# Altium project Rys_PCB.PrjPcb
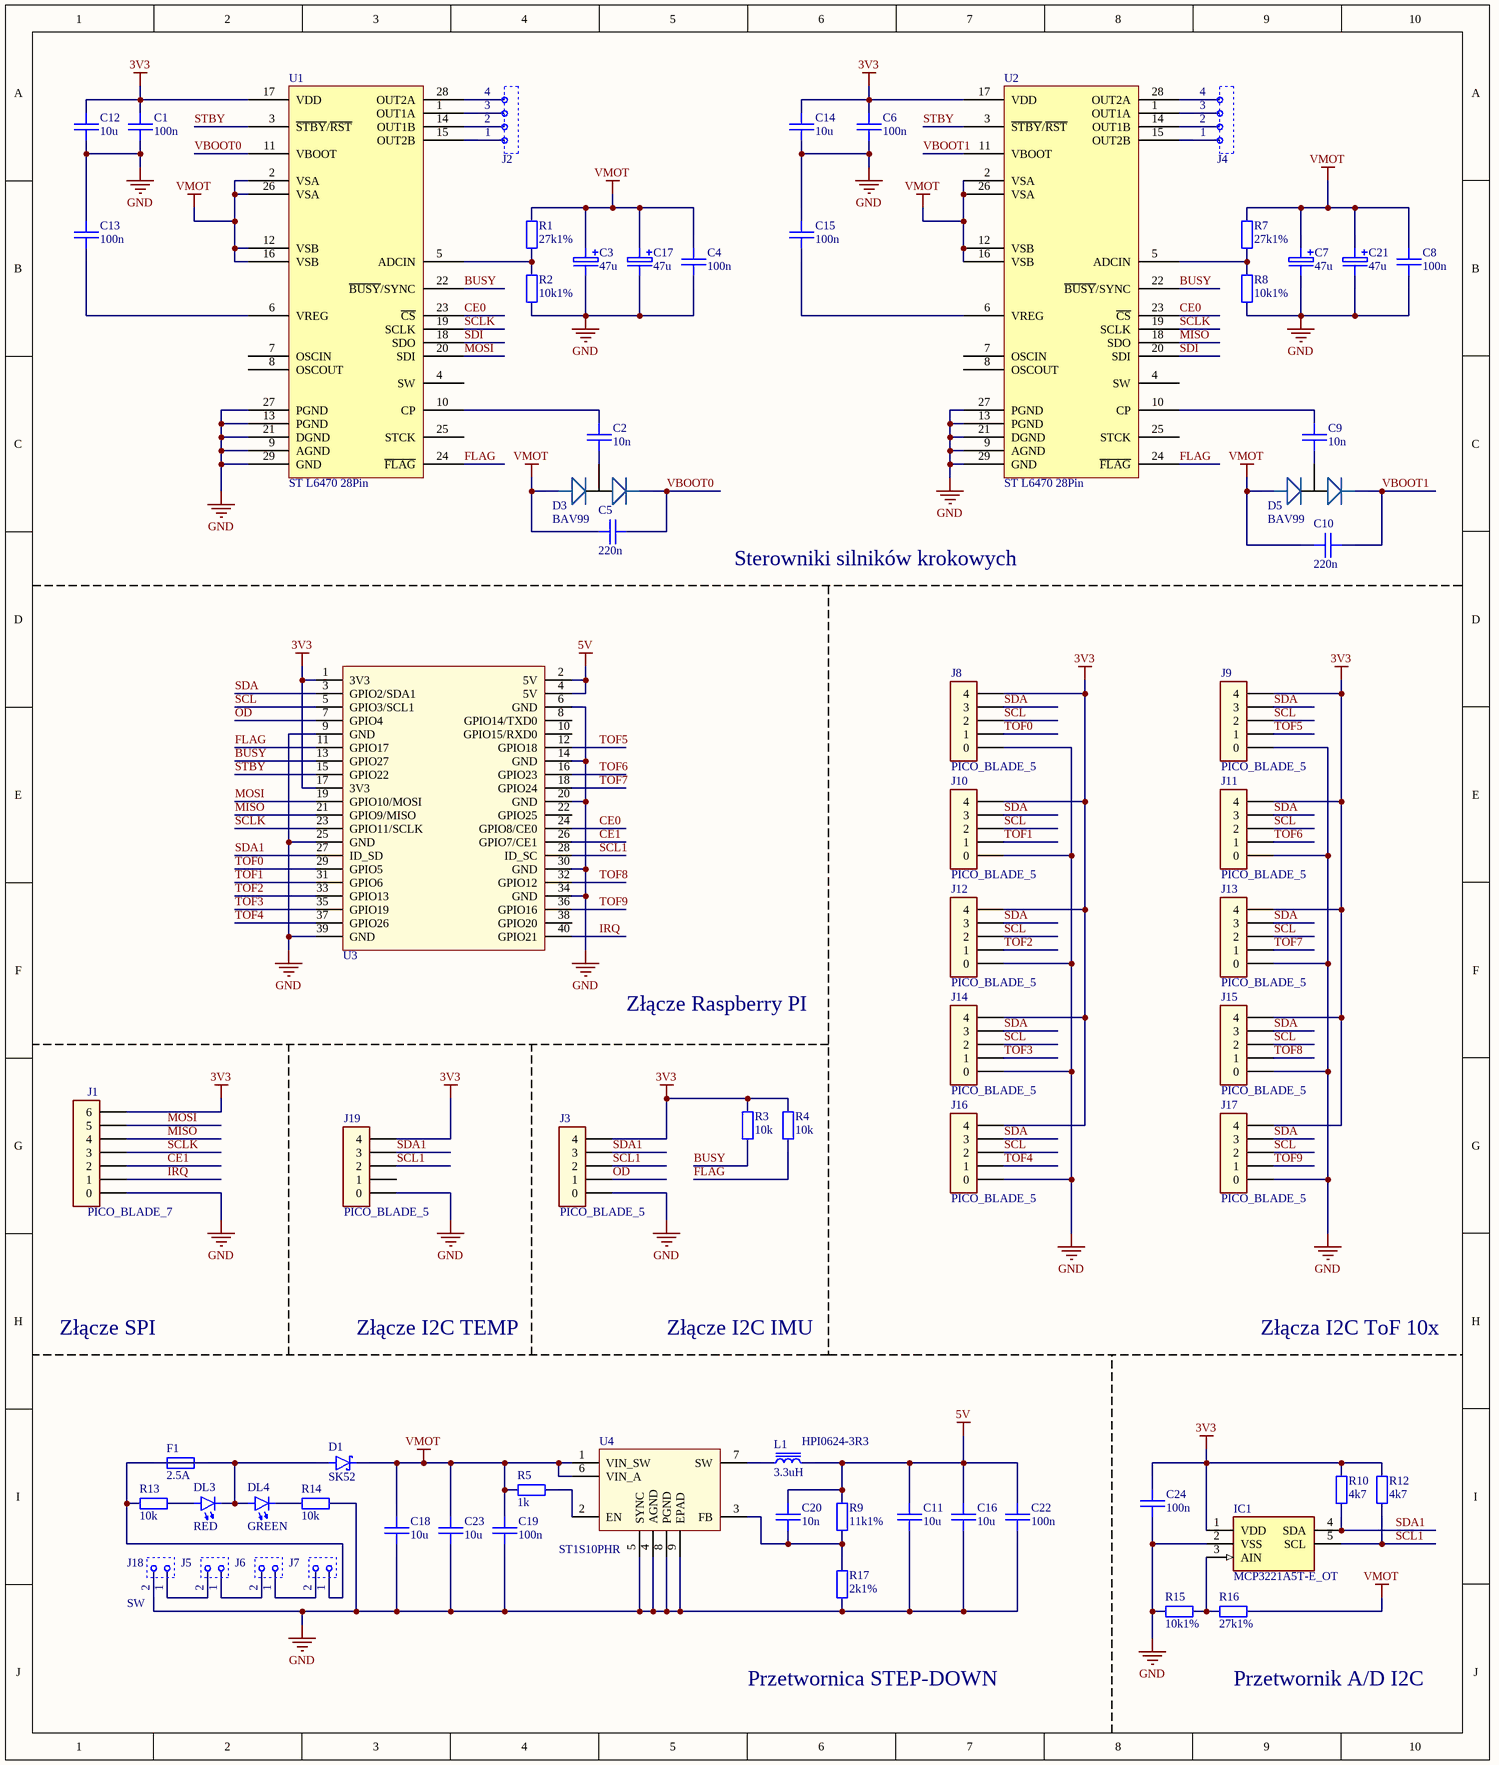
[diagram p0: rys_PCB.SchDoc]
1 sheet, 70 parts. Net scope: global (net labels, ports and power ports of the same name join across sheets).
Board file: rys_PCB.PcbDoc

## Sheet rys_PCB.SchDoc
size 279 x 330 mm; Organization: Altium Limited; Address1: L3, 12a Rodborough Rd; Address2: Frenchs Forest; Address3: NSW; Address4: Australia 2086

### Parts
C1  100n  [0603]
C2  10n  [0603]
C3  47u  [_C_TAN_D]
C4  100n  [0603]
C5  220n  [0805]
C6  100n  [0603]
C7  47u  [_C_TAN_D]
C8  100n  [0603]
C9  10n  [0603]
C10  220n  [0805]
C11  10u  [1210_C]
C12  10u  [1206_C]
C13  100n  [0603]
C14  10u  [1206_C]
C15  100n  [0603]
C16  10u  [1210_C]
C17  47u  [_C_TAN_D]
C18  10u  [1210_C]
C19  100n  [0805]
C20  10n  [0603]
C21  47u  [_C_TAN_D]
C22  100n  [0805]
C23  10u  [1210_C]
C24  100n  [0603]
D1  SK52  [SMB/DO-214AA]
D3  BAV99  [SOT-23]
D5  BAV99  [SOT-23]
DL3  RED  [0805_LED]
DL4  GREEN  [0805_LED]
F1  2.5A  [1206_R]
IC1  MCP3221A5T-E_OT  [SOT95P280X145-5N]
J1  PICO_BLADE_7  [PicoBlade_THT_1x7_HEADER]
J2  Molex Microfit  [MICROFIT 4x1 Vertical]  (value not drawn)
J3  PICO_BLADE_5  [PicoBlade_THT_1x5_HEADER]
J4  Molex Microfit  [MICROFIT 4x1 Vertical]  (value not drawn)
J5  Molex Microfit  [MICROFIT 1x2 Vertical]  (value not drawn)
J6  Molex Microfit  [MICROFIT 1x2 Vertical]  (value not drawn)
J7  Molex Microfit  [MICROFIT 1x2 Vertical]  (value not drawn)
J8  PICO_BLADE_5  [PicoBlade_THT_1x5_HEADER]
J9  PICO_BLADE_5  [PicoBlade_THT_1x5_HEADER]
J10  PICO_BLADE_5  [PicoBlade_THT_1x5_HEADER]
J11  PICO_BLADE_5  [PicoBlade_THT_1x5_HEADER]
J12  PICO_BLADE_5  [PicoBlade_THT_1x5_HEADER]
J13  PICO_BLADE_5  [PicoBlade_THT_1x5_HEADER]
J14  PICO_BLADE_5  [PicoBlade_THT_1x5_HEADER]
J15  PICO_BLADE_5  [PicoBlade_THT_1x5_HEADER]
J16  PICO_BLADE_5  [PicoBlade_THT_1x5_HEADER]
J17  PICO_BLADE_5  [PicoBlade_THT_1x5_HEADER]
J18  Molex Microfit  [MICROFIT 1x2 Vertical]  (value not drawn)
J19  PICO_BLADE_5  [PicoBlade_THT_1x5_HEADER]
L1  3.3uH  Symbol: HPI0624-3R3  [L_HPI0624]
R1  27k1%  [0603_R]
R2  10k1%  [0603_R]
R3  10k  [0603_R]
R4  10k  [0603_R]
R5  1k  [0603_R]
R7  27k1%  [0603_R]
R8  10k1%  [0603_R]
R9  11k1%  [0603_R]
R10  4k7  [0603_R]
R12  4k7  [0603_R]
R13  10k  [0603_R]
R14  10k  [0603_R]
R15  10k1%  [0603_R]
R16  27k1%  [0603_R]
R17  2k1%  [0603_R]
U1  ST L6470 28Pin  [ST HTSSOP-28]
U2  ST L6470 28Pin  [ST HTSSOP-28]
U3  RaspberryPi_3B+  [RaspberryPi_S]  (value not drawn)
U4  ST1S10PHR  [HSOP8]

### Nets
3V3: C1.2 C6.2 C12.2 C14.2 C24.2 IC1.1(VDD) J1.6 J3.4 J8.4 J9.4 J10.4 J11.4 J12.4 J13.4 J14.4 J15.4 J16.4 J17.4 J19.4 R3.2 R4.2 R10.2 R12.2 U1.17(VDD) U2.17(VDD) U3.1(3V3) U3.17(3V3)
5V: C11.2 C16.2 C20.2 C22.2 L1.1 R9.2 U3.2(5V) U3.4(5V)
GND: C1.1 C3.N C4.2 C6.1 C7.N C8.2 C11.1 C12.1 C13.2 C14.1 C15.2 C16.1 C17.N C18.1 C19.1 C21.N C22.1 C23.1 C24.1 IC1.2(VSS) J1.0 J3.0 J8.0 J9.0 J10.0 J11.0 J12.0 J13.0 J14.0 J15.0 J16.0 J17.0 J18.2 J19.0 R2.1 R8.1 R14.1 R15.1 R17.1 U1.9(AGND) U1.13(PGND) U1.21(DGND) U1.27(PGND) U1.29(GND) U2.9(AGND) U2.13(PGND) U2.21(DGND) U2.27(PGND) U2.29(GND) U3.6(GND) U3.9(GND) U3.14(GND) U3.20(GND) U3.25(GND) U3.30(GND) U3.34(GND) U3.39(GND) U4.4(AGND) U4.5(SYNC) U4.8(PGND) U4.9(EPAD)
VMOT: C3.P C4.1 C5.2 C7.P C8.1 C10.2 C17.P C18.2 C19.2 C21.P C23.2 D1.K D3.1 D5.1 R1.2 R5.2 R7.2 R16.2 U1.2(VSA) U1.12(VSB) U1.16(VSB) U1.26(VSA) U2.2(VSA) U2.12(VSB) U2.16(VSB) U2.26(VSA) U4.1(VIN_SW) U4.6(VIN_A)
BUSY: R3.1 U1.22(~{BUSY}/SYNC) U2.22(~{BUSY}/SYNC) U3.13(GPIO27)
CE0: U1.23(~{CS}) U2.23(~{CS}) U3.24(GPIO8/CE0)
CE1: J1.2 U3.26(GPIO7/CE1)
FLAG: R4.1 U1.24(~{FLAG}) U2.24(~{FLAG}) U3.11(GPIO17)
IRQ: J1.1 U3.40(GPIO21)
MISO: J1.4 U2.18(SDO) U3.21(GPIO9/MISO)
MOSI: J1.5 U1.20(SDI) U3.19(GPIO10/MOSI)
O~{D}: J3.1 U3.7(GPIO4)
SCL: J8.2 J9.2 J10.2 J11.2 J12.2 J13.2 J14.2 J15.2 J16.2 J17.2 U3.5(GPIO3/SCL1)
SCL1: IC1.5(SCL) J3.2 J19.2 R12.1 U3.28(ID_SC)
SCLK: J1.3 U1.19(SCLK) U2.19(SCLK) U3.23(GPIO11/SCLK)
SDA: J8.3 J9.3 J10.3 J11.3 J12.3 J13.3 J14.3 J15.3 J16.3 J17.3 U3.3(GPIO2/SDA1)
SDA1: IC1.4(SDA) J3.3 J19.3 R10.1 U3.27(ID_SD)
SDI: U1.18(SDO) U2.20(SDI)
STBY: U1.3(~{STBY}/~{RST}) U2.3(~{STBY}/~{RST}) U3.15(GPIO22)
TOF0: J8.1 U3.29(GPIO5)
TOF1: J10.1 U3.31(GPIO6)
TOF2: J12.1 U3.33(GPIO13)
TOF3: J14.1 U3.35(GPIO19)
TOF4: J16.1 U3.37(GPIO26)
TOF5: J9.1 U3.12(GPIO18)
TOF6: J11.1 U3.16(GPIO23)
TOF7: J13.1 U3.18(GPIO24)
TOF8: J15.1 U3.32(GPIO12)
TOF9: J17.1 U3.36(GPIO16)
VBOOT0: C5.1 D3.2 U1.11(VBOOT)
VBOOT1: C10.1 D5.2 U2.11(VBOOT)
NetC2_1: C2.1 D3.3
NetC2_2: C2.2 U1.10(CP)
NetC9_1: C9.1 D5.3
NetC9_2: C9.2 U2.10(CP)
NetC13_1: C13.1 U1.6(VREG)
NetC15_1: C15.1 U2.6(VREG)
NetC20_1: C20.1 R9.1 R17.2 U4.3(FB)
NetD1_A: D1.A DL3.K DL4.A F1.1
NetDL3_A: DL3.A R13.1
NetDL4_K: DL4.K R14.2
NetF1_2: F1.2 J7.1 R13.2
NetIC1_3: IC1.3(AIN) R15.2 R16.1
NetJ2_1: J2.1 U1.15(OUT2B)
NetJ2_2: J2.2 U1.14(OUT1B)
NetJ2_3: J2.3 U1.1(OUT1A)
NetJ2_4: J2.4 U1.28(OUT2A)
NetJ4_1: J4.1 U2.15(OUT2B)
NetJ4_2: J4.2 U2.14(OUT1B)
NetJ4_3: J4.3 U2.1(OUT1A)
NetJ4_4: J4.4 U2.28(OUT2A)
NetJ5_1: J5.1 J6.2
NetJ5_2: J5.2 J18.1
NetJ6_1: J6.1 J7.2
NetL1_2: L1.2 U4.7(SW)
NetR1_1: R1.1 R2.2 U1.5(ADCIN)
NetR5_1: R5.1 U4.2(EN)
NetR7_1: R7.1 R8.2 U2.5(ADCIN)

Not connected (* = marked no-connect by the designer): J19 1; U1 4(SW) 7(OSCIN) 8(OSCOUT) 25(STCK); U2 4(SW) 7(OSCIN) 8(OSCOUT) 25(STCK); U3 8(GPIO14/TXD0) 10(GPIO15/RXD0) 22(GPIO25) 38(GPIO20)

### Notes on the sheet
- Sterowniki silników krokowych
- Złącze Raspberry PI
- Złącze SPI
- Złącze I2C TEMP
- Złącze I2C IMU
- Złącza I2C ToF 10x
- (near J18) SW
- Przetwornica STEP-DOWN
- Przetwornik A/D I2C
- Title
- Size:
- Date:
- A3
- Number:
- Time:
- Revision:
- Sheet
- of
- File:

### Library data of the parts
C1 C2 C4-C6 C8-C16 C18-C20 C22-C24 = C_CER: Ceramic Capacitor
C3 C7 C17 C21 = C_TAN: Tantalum Capacitor
D1 = SK26: Schottky Diode 2A 60V; Supplier: TME; URL: https://www.tme.eu/pl/details/sk52-dio/diody-schottky-smd/diotec-semiconductor/sk52/; Symbol: SK52
D3 D5 = BAV99: Charge pump diode; ComponentLink1Description: Supplier; ComponentLink1URL: https://www.tme.eu/pl/details/bav99-dio/diody-uniwersalne-smd/diotec-semiconductor/bav99/?gclid=CjwKCAjwuO3cBRAyEiwAzOxKsjEfIjBEMiuf1MfOOw41XfFBLf9W3FTm4SrcCEQFmDl5D7iYJBHTpRoCdegQAvD_BwE
DL3 DL4 = LED1: Light Emitting Diode
F1 = F: Fuse; URL: https://www.tme.eu/pl/details/bsmd1206-ss2.5/bezpieczniki-smd-1206-superszybkie/eska/fuse-1206-ff-pw-2a5/
IC1 = MCP3221A5T-E_OT: Integrated Circuit; Manufacturer_Name: Microchip; Manufacturer_Part_Number: MCP3221A5T-E/OT; Allied_Number: 70046146; Datasheet Link: http://ww1.microchip.com/downloads/en/DeviceDoc/21732D.pdf; Height: 1.45mm; Mouser Part Number: 579-MCP3221A5T-E/OT; Mouser Price/Stock: https://www.mouser.com/Search/Refine.aspx?Keyword=579-MCP3221A5T-E%2FOT; RS Part Number: 1653428; RS Price/Stock: http://uk.rs-online.com/web/p/products/1653428; Allied Price/Stock: http://www.alliedelec.com/microchip-technology-inc-mcp3221a5t-e-ot/70046146/; URL: https://www.tme.eu/pl/details/mcp3221a2t-e_ot/przetworniki-a-d-uklady-scalone/microchip-technology/mcp3221a2t-e-ot/
J1 = PICO_BLADE_7: 1x7 header; URL: https://www.tme.eu/pl/details/mx-53047-0510/zlacza-sygnalowe-raster-125mm/molex/530470510/
J2 J4 = Microfit 1x4: Symbol: Molex 436500429; Supplier: TME; URL: https://www.tme.eu/pl/details/mx-43650-0429/zlacza-sygnalowe-raster-300mm/molex/43650-0429/
J3 J8-J17 J19 = PICO_BLADE_5: 1x5 header; URL: https://www.tme.eu/pl/details/mx-53047-0510/zlacza-sygnalowe-raster-125mm/molex/530470510/
J5-J7 J18 = Microfit 2x1: Symbol: Molex 430450212; Supplier: TME
L1 = L_IND_HPI0624-3R3: Inductor; Supplier: TME; URL: https://www.tme.eu/pl/details/hpi0624-3r3/dlawiki-smd-mocy/ferrocore/
R1-R5 R7-R10 R12-R17 = R: Resistor
U1 U2 = ST L6470 28Pin: SPI stepper driver
U4 = ST1S10PHR: DC/DC converter 3A; Supplier: TME; URL: https://www.tme.eu/pl/details/st1s14phr/regulatory-napiecia-uklady-dcdc/st-microelectronics/